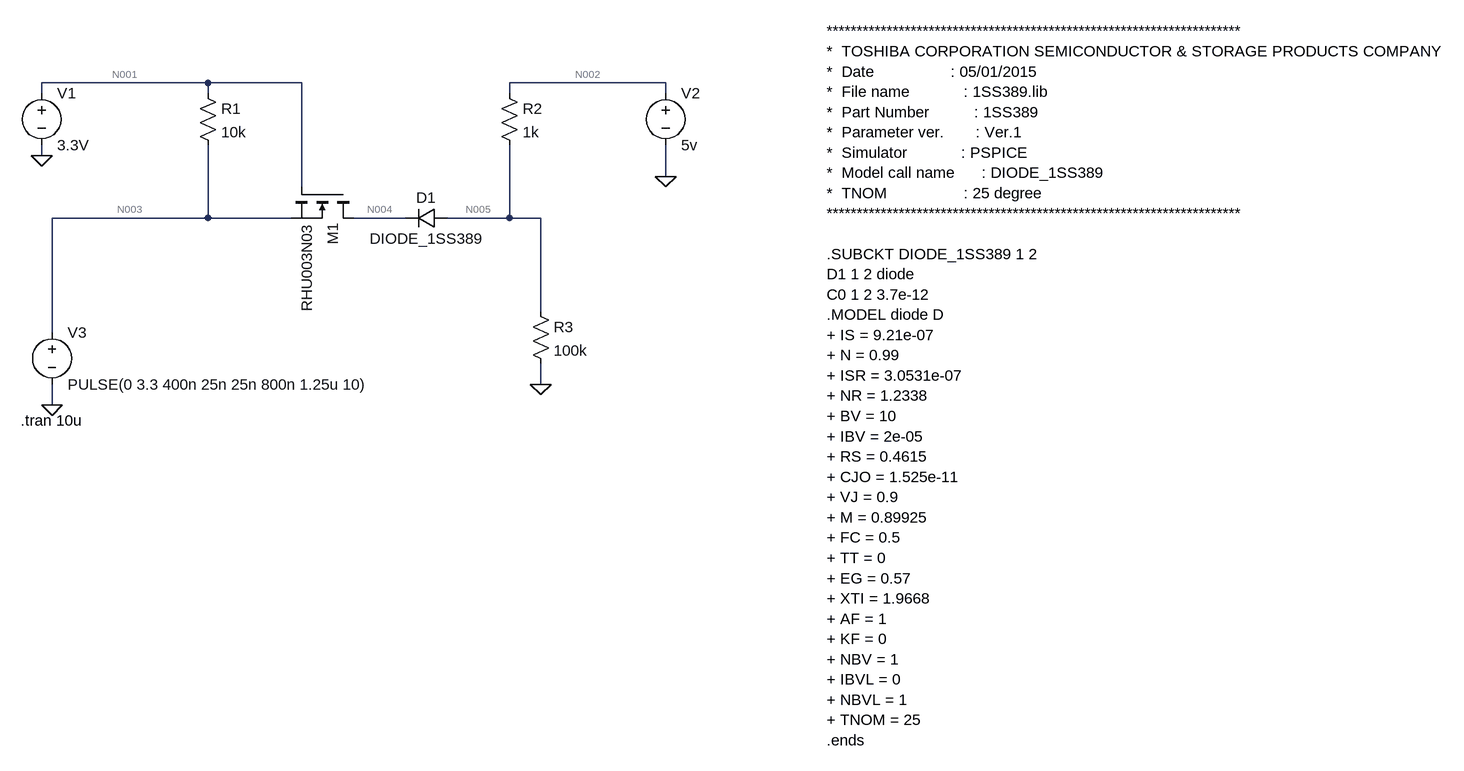
[diagram p0: schematic Level translator.asc]
Level translator.asc, the LTspice schematic file:
Version 4
SHEET 1 1980 836
WIRE 16 -80 -240 -80
WIRE 160 -80 16 -80
WIRE 720 -80 480 -80
WIRE -240 -64 -240 -80
WIRE 16 -64 16 -80
WIRE 480 -64 480 -80
WIRE 720 -64 720 -80
WIRE -240 32 -240 16
WIRE 720 64 720 16
WIRE 160 80 160 -80
WIRE 16 128 16 16
WIRE 16 128 -224 128
WIRE 144 128 16 128
WIRE 320 128 240 128
WIRE 480 128 480 16
WIRE 480 128 384 128
WIRE 528 128 480 128
WIRE 528 272 528 128
WIRE -224 304 -224 128
WIRE 528 384 528 352
WIRE -224 416 -224 384
FLAG -224 416 0
FLAG -240 32 0
FLAG 720 64 0
FLAG 528 384 0
SYMBOL nmos 240 80 R90
SYMATTR InstName M1
SYMATTR Value RHU003N03
SYMBOL res 0 -80 R0
SYMATTR InstName R1
SYMATTR Value 10k
SYMBOL res 464 -80 R0
SYMATTR InstName R2
SYMATTR Value 1k
SYMBOL voltage -240 -80 R0
WINDOW 123 0 0 Left 0
WINDOW 39 0 0 Left 0
SYMATTR InstName V1
SYMATTR Value 3.3V
SYMBOL voltage 720 -80 R0
WINDOW 123 0 0 Left 0
WINDOW 39 0 0 Left 0
SYMATTR InstName V2
SYMATTR Value 5v
SYMBOL voltage -224 288 R0
WINDOW 123 0 0 Left 0
WINDOW 39 0 0 Left 0
SYMATTR InstName V3
SYMATTR Value PULSE(0 3.3 400n 25n 25n 800n 1.25u 10)
SYMBOL res 512 256 R0
SYMATTR InstName R3
SYMATTR Value 100k
SYMBOL diode 384 112 R90
WINDOW 0 0 32 VBottom 2
WINDOW 3 32 32 VTop 2
SYMATTR InstName D1
SYMATTR Value DIODE_1SS389
SYMATTR Prefix X
TEXT -272 440 Left 2 !.tran 10u
TEXT 968 -160 Left 2 !*********************************************************************\n*  TOSHIBA CORPORATION SEMICONDUCTOR & STORAGE PRODUCTS COMPANY\n*  Date                 : 05/01/2015\n*  File name            : 1SS389.lib\n*  Part Number          : 1SS389\n*  Parameter ver.       : Ver.1\n*  Simulator            : PSPICE\n*  Model call name      : DIODE_1SS389\n*  TNOM                 : 25 degree\n*********************************************************************\n \n.SUBCKT DIODE_1SS389 1 2\nD1 1 2 diode\nC0 1 2 3.7e-12\n.MODEL diode D\n+ IS = 9.21e-07\n+ N = 0.99\n+ ISR = 3.0531e-07\n+ NR = 1.2338\n+ BV = 10\n+ IBV = 2e-05\n+ RS = 0.4615\n+ CJO = 1.525e-11\n+ VJ = 0.9\n+ M = 0.89925\n+ FC = 0.5\n+ TT = 0\n+ EG = 0.57\n+ XTI = 1.9668\n+ AF = 1\n+ KF = 0\n+ NBV = 1\n+ IBVL = 0\n+ NBVL = 1\n+ TNOM = 25\n.ends

The netlist it stands for:
* Level translator.asc
M1 N004 N001 N003 N003 RHU003N03
R1 N001 N003 10k
R2 N002 N005 1k
V1 N001 0 3.3V
V2 N002 0 5v
V3 N003 0 PULSE(0 3.3 400n 25n 25n 800n 1.25u 10)
R3 N005 0 100k
XD1 N005 N004 DIODE_1SS389  ; pins + -
.model NMOS NMOS
.model PMOS PMOS
.lib standard.mos
.tran 10u
*********************************************************************
*  TOSHIBA CORPORATION SEMICONDUCTOR & STORAGE PRODUCTS COMPANY
*  Date                 : 05/01/2015
*  File name            : 1SS389.lib
*  Part Number          : 1SS389
*  Parameter ver.       : Ver.1
*  Simulator            : PSPICE
*  Model call name      : DIODE_1SS389
*  TNOM                 : 25 degree
*********************************************************************
.SUBCKT DIODE_1SS389 1 2
D1 1 2 diode
C0 1 2 3.7e-12
.MODEL diode D
+ IS = 9.21e-07
+ N = 0.99
+ ISR = 3.0531e-07
+ NR = 1.2338
+ BV = 10
+ IBV = 2e-05
+ RS = 0.4615
+ CJO = 1.525e-11
+ VJ = 0.9
+ M = 0.89925
+ FC = 0.5
+ TT = 0
+ EG = 0.57
+ XTI = 1.9668
+ AF = 1
+ KF = 0
+ NBV = 1
+ IBVL = 0
+ NBVL = 1
+ TNOM = 25
.ends
.backanno
.end

* Results of the author's LTspice run, read from the files saved beside the schematic
* Operating Point, zero values left out:
*   V(n004) = 8.26 mV
*   V(n001) = 3.3 V
*   V(n002) = 5 V
*   V(n005) = 224.1 mV
*   Id(M1) = 4.774 mA
*   Is(M1) = -4.774 mA
*   I(R3) = 2.241 µA
*   I(R2) = 4.776 mA
*   I(R1) = 330 µA
*   I(V3) = 5.104 mA
*   I(V2) = -4.776 mA
*   I(V1) = -330 µA
*   Ix(d1:1) = 4.774 mA
*   Ix(d1:2) = -4.774 mA
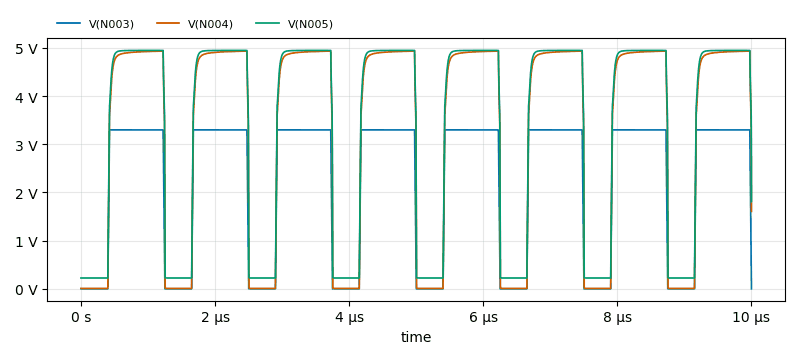
[diagram p1: Transient Analysis of Level translator.asc, plotted from the saved traces]
* Transient Analysis, 1 run:
*   V(N003): min 0 V, max 3.3 V, average 2.178 V, rms 2.667 V, last 0 V
*   V(N004): min 8.259 mV, max 4.935 V, average 3.221 V, rms 3.935 V, last 1.605 V
*   V(N005): min 224.1 mV, max 4.95 V, average 3.329 V, rms 3.979 V, last 1.809 V